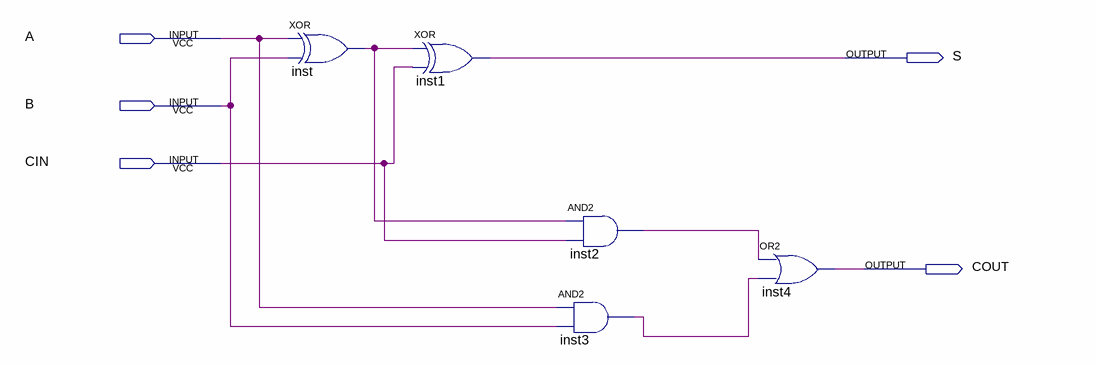
[diagram p0: schematic sheet]
// Quartus schematic Full_add_1bit.bdf as structural Verilog: 5 symbols, 5 pins
module Full_add_1bit (
  input  A,
  input  B,
  input  CIN,
  output S,
  output COUT
);

  wire inst2_out, inst3_out, inst_out;

  xor inst (inst_out, A, B);
  xor inst1 (S, inst_out, CIN);
  and inst2 (inst2_out, inst_out, CIN);
  and inst3 (inst3_out, A, B);
  or inst4 (COUT, inst2_out, inst3_out);
endmodule
